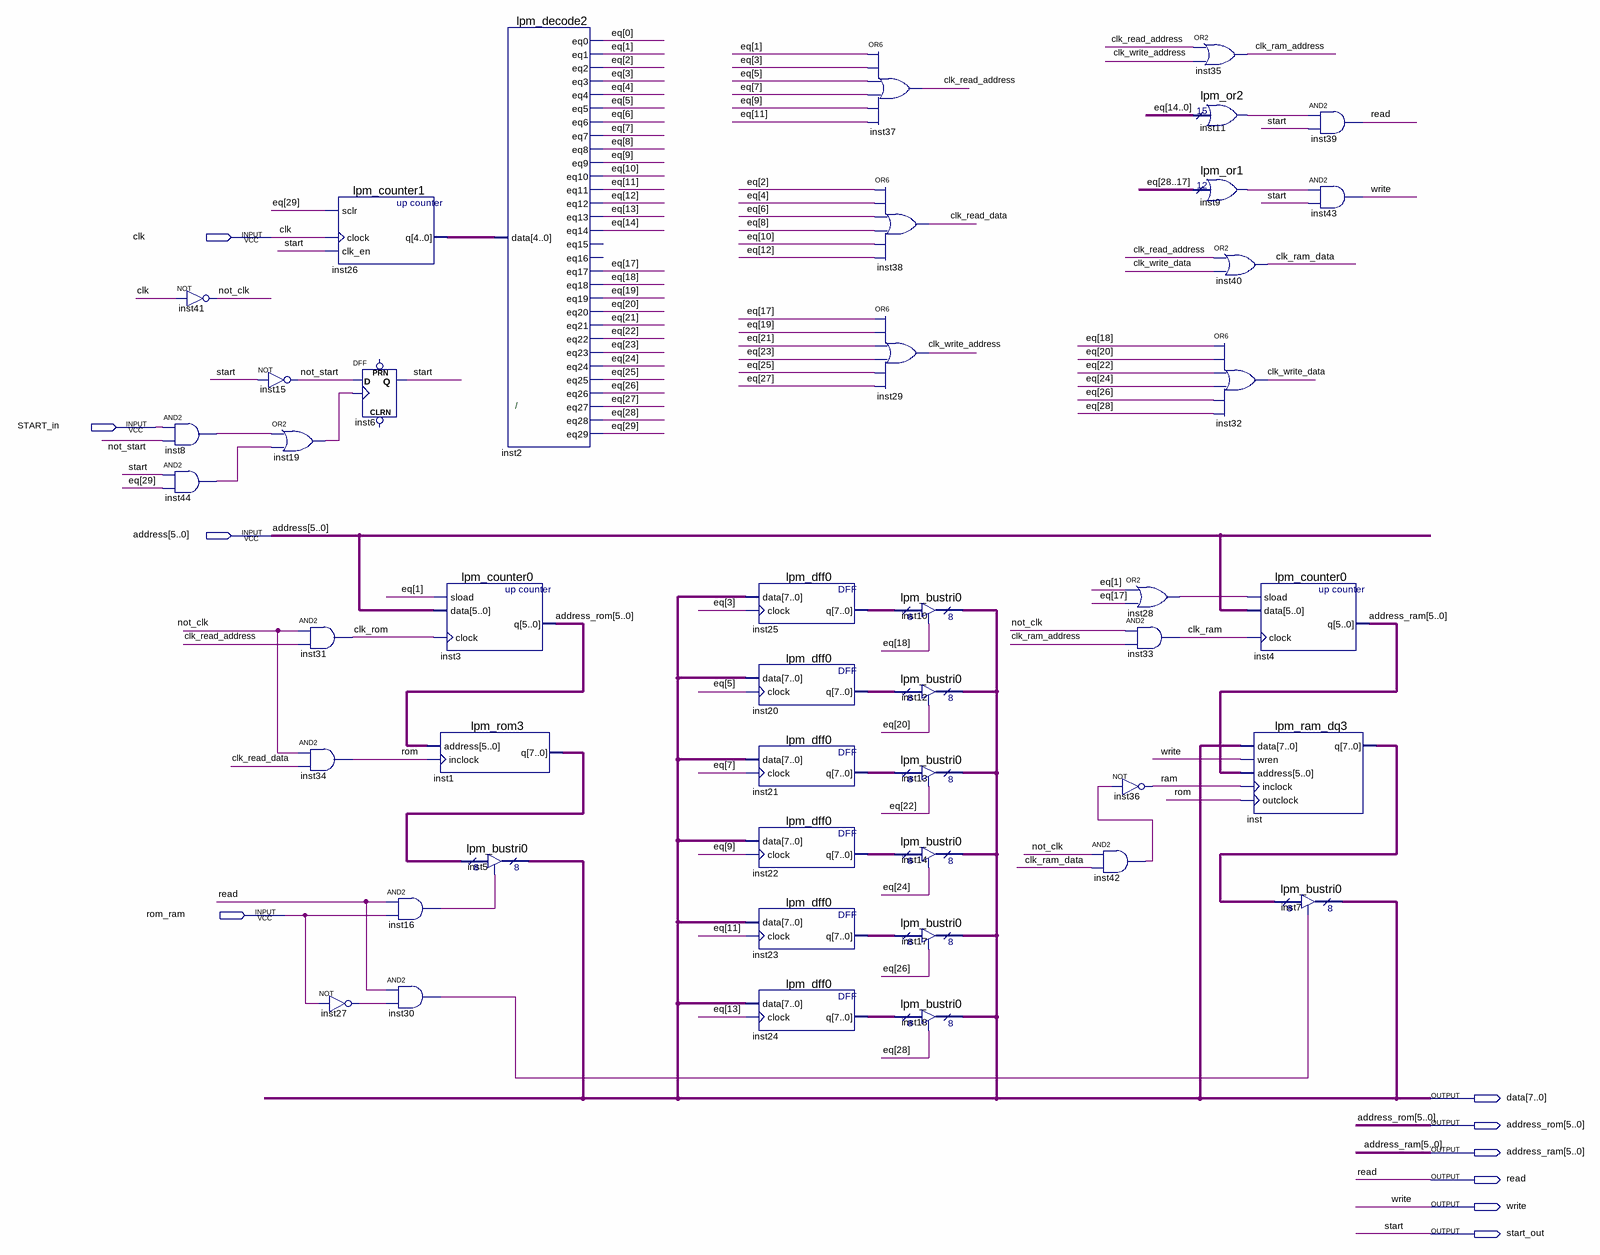
[diagram p0: schematic sheet]
// Quartus schematic Lab_3.bdf as structural Verilog: 45 symbols, 10 pins
module Lab_3 (
  input  clk,
  input  START_in,
  input  [5:0] address,
  input  rom_ram,
  output [7:0] data,
  output [5:0] address_rom,
  output [5:0] address_ram,
  output read,
  output write,
  output start_out
);

  wire clk_ram, clk_ram_address, clk_ram_data, clk_read_address, clk_read_data, clk_rom, clk_write_address,
       clk_write_data, inst8_out, inst9_result, inst11_result, inst16_out, inst19_out, inst27_out,
       inst28_out, inst30_out, inst42_out, inst44_out, not_clk, not_start, ram, rom;
  wire [4:0] inst26_q;
  wire [7:0] inst1_q, inst20_q, inst21_q, inst22_q, inst23_q, inst24_q, inst25_q, inst_q;
  wire [29:0] eq;

  and inst8 (inst8_out, START_in, not_start);
  and inst44 (inst44_out, start_out, eq[29]);
  not inst41 (not_clk, clk);
  not inst15 (not_start, start_out);
  or inst19 (inst19_out, inst8_out, inst44_out);
  lpm_counter1 inst26 (.sclr(eq[29]), .clock(clk), .clk_en(start_out), .q(inst26_q));
  and inst31 (clk_rom, not_clk, clk_read_address);
  and inst34 (rom, not_clk, clk_read_data);
  not inst27 (inst27_out, rom_ram);
  DFF inst6 (.CLK(inst19_out), .D(not_start), .Q(start_out));  // open: CLRN, PRN
  lpm_counter0 inst3 (.sload(eq[1]), .data(address), .clock(clk_rom), .q(address_rom));
  lpm_rom3 inst1 (.address(address_rom), .inclock(rom), .q(inst1_q));
  and inst16 (inst16_out, read, rom_ram);
  and inst30 (inst30_out, read, inst27_out);
  lpm_bustri0 inst5 (.enabledt(inst16_out), .data(inst1_q), .tridata(data));
  lpm_decode2 inst2 (
    .data(inst26_q), .eq0(eq[0]), .eq1(eq[1]), .eq2(eq[2]), .eq3(eq[3]), .eq4(eq[4]), .eq5(eq[5]),
    .eq6(eq[6]), .eq7(eq[7]), .eq8(eq[8]), .eq9(eq[9]), .eq10(eq[10]), .eq11(eq[11]), .eq12(eq[12]),
    .eq13(eq[13]), .eq14(eq[14]), .eq17(eq[17]), .eq18(eq[18]), .eq19(eq[19]), .eq20(eq[20]), .eq21(eq[21]),
    .eq22(eq[22]), .eq23(eq[23]), .eq24(eq[24]), .eq25(eq[25]), .eq26(eq[26]), .eq27(eq[27]), .eq28(eq[28]),
    .eq29(eq[29]));  // open: eq15, eq16
  lpm_dff0 inst25 (.data(data), .clock(eq[3]), .q(inst25_q));
  lpm_dff0 inst20 (.data(data), .clock(eq[5]), .q(inst20_q));
  lpm_dff0 inst21 (.data(data), .clock(eq[7]), .q(inst21_q));
  lpm_dff0 inst22 (.data(data), .clock(eq[9]), .q(inst22_q));
  lpm_dff0 inst23 (.data(data), .clock(eq[11]), .q(inst23_q));
  lpm_dff0 inst24 (.data(data), .clock(eq[13]), .q(inst24_q));
  or inst37 (clk_read_address, eq[1], eq[3], eq[5], eq[7], eq[9], eq[11]);
  or inst38 (clk_read_data, eq[2], eq[4], eq[6], eq[8], eq[10], eq[12]);
  or inst29 (clk_write_address, eq[17], eq[19], eq[21], eq[23], eq[25], eq[27]);
  lpm_bustri0 inst10 (.enabledt(eq[18]), .data(inst25_q), .tridata(data));
  lpm_bustri0 inst12 (.enabledt(eq[20]), .data(inst20_q), .tridata(data));
  lpm_bustri0 inst13 (.enabledt(eq[22]), .data(inst21_q), .tridata(data));
  lpm_bustri0 inst14 (.enabledt(eq[24]), .data(inst22_q), .tridata(data));
  lpm_bustri0 inst17 (.enabledt(eq[26]), .data(inst23_q), .tridata(data));
  lpm_bustri0 inst18 (.enabledt(eq[28]), .data(inst24_q), .tridata(data));
  or inst28 (inst28_out, eq[1], eq[17]);
  and inst33 (clk_ram, not_clk, clk_ram_address);
  not inst36 (ram, inst42_out);
  and inst42 (inst42_out, not_clk, clk_ram_data);
  or inst35 (clk_ram_address, clk_read_address, clk_write_address);
  lpm_or2 inst11 (.data(eq[14:0]), .result(inst11_result));
  lpm_or1 inst9 (.data(eq[28:17]), .result(inst9_result));
  or inst40 (clk_ram_data, clk_read_address, clk_write_data);
  or inst32 (clk_write_data, eq[18], eq[20], eq[22], eq[24], eq[26], eq[28]);
  lpm_counter0 inst4 (.sload(inst28_out), .data(address), .clock(clk_ram), .q(address_ram));
  lpm_ram_dq3 inst (.data(data), .wren(write), .address(address_ram), .inclock(ram), .outclock(rom), .q(inst_q));
  lpm_bustri0 inst7 (.enabledt(inst30_out), .data(inst_q), .tridata(data));
  and inst39 (read, inst11_result, start_out);
  and inst43 (write, inst9_result, start_out);

  // Other names for the same wires on the sheet: start = start_out

  // Notes on the sheet:
  //   /
endmodule
